# Altium schematic sheet Esquematico.SchDoc
size A4
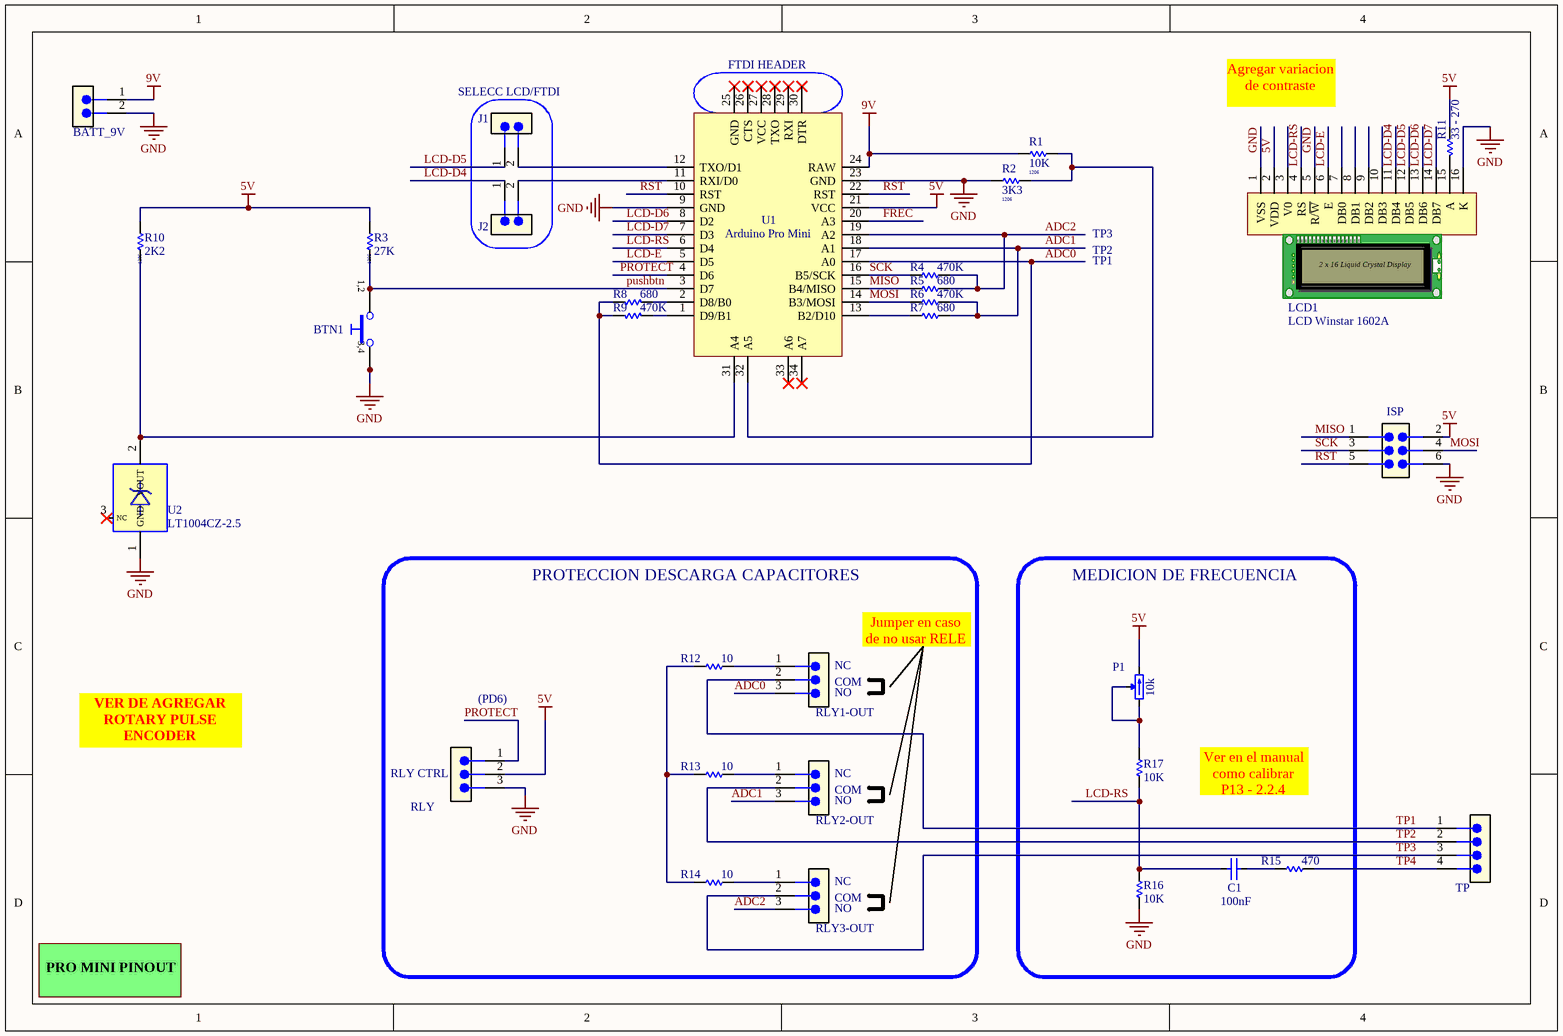
[diagram p0: Esquematico.SchDoc]

## Parts
BATT_9V  M20-9 73 02 46  [HEADER2X1]  (value not drawn)
BTN1  Push Button  [PB_OMRON_B3F-1070]  (value not drawn)
C1  100nF  [1206 - CAP]
ISP  M20-9 72 03 46  [HEADER3X2]  (value not drawn)
J1  M20-9 73 02 46  [HEADER2X1]  (value not drawn)
J2  M20-9 73 02 46  [HEADER2X1]  (value not drawn)
LCD1  LCD Winstar 1602A  [LCD_1602A]
P1  10k  [TRIM_BOURNS_3266W]
R1  10K  Package: 1206  [1206 - RES]
R2  3K3  Package: 1206  [1206 - RES]
R3  27K  Package: 1206  [1206 - RES]
R4  470K  [1206 - RES]
R5  680  [1206 - RES]
R6  470K  [1206 - RES]
R7  680  [1206 - RES]
R8  680  [1206 - RES]
R9  470K  [1206 - RES]
R10  2K2  Package: 1206  [1206 - RES]
R11  33 - 270  [1206 - RES]
R12  10  [1206 - RES]
R13  10  [1206 - RES]
R14  10  [1206 - RES]
R15  470  [1206 - RES]
R16  10K  [1206 - RES]
R17  10K  [1206 - RES]
RLY  HEADER 3X1  [HEADER3X1]  (value not drawn)
RLY1-OUT  HEADER 3X1  [HEADER3X1]  (value not drawn)
RLY2-OUT  HEADER 3X1  [HEADER3X1]  (value not drawn)
RLY3-OUT  HEADER 3X1  [HEADER3X1]  (value not drawn)
TP  M20-9 73 04 46  [HEADER4X1]  (value not drawn)
U1  Arduino Pro Mini  [Arduino Pro Mini]
U2  LT1004CZ-2.5  [TO-92]

## Blocks framed on the sheet
PROTECCION DESCARGA CAPACITORES: R12-R14 RLY RLY1-OUT RLY2-OUT RLY3-OUT
MEDICION DE FRECUENCIA: C1 P1 R15-R17

## Sub-sheets
PRO MINI PINOUT = PinOut.SchDoc: no entries

## Nets
5V: ISP.2 LCD1.2(VDD) P1.3(CW) R3.2 R10.2 R11.2 RLY.2 U1.21(VCC)
9V: BATT_9V.1 R1.2 U1.24(RAW)
GND: BATT_9V.2 BTN1.3 BTN1.4 ISP.6 LCD1.1(VSS) LCD1.5(R/~{W}) LCD1.16(K) R2.2 R16.1 RLY.3 U1.9(GND) U1.23(GND) U2.1(GND)
ADC0: R8.1 R9.1 RLY1-OUT.3 U1.17(A0)
ADC1: R6.1 R7.1 RLY2-OUT.3 U1.18(A1)
ADC2: R4.1 R5.1 RLY3-OUT.3 U1.19(A2)
FREC: U1.20(A3)
LCD-D4: J2.1 LCD1.11(DB4)
LCD-D5: J1.1 LCD1.12(DB5)
LCD-D6: LCD1.13(DB6) U1.8(D2)
LCD-D7: LCD1.14(DB7) U1.7(D3)
LCD-E: LCD1.6(E) U1.5(D5)
LCD-RS: C1.1 LCD1.4(RS) R16.2 R17.1 U1.6(D4)
MISO: ISP.1 R5.2 U1.15(B4/MISO)
MOSI: ISP.4 R6.2 U1.14(B3/MOSI)
PROTECT: RLY.1 U1.4(D6)
pushbtn: BTN1.1 BTN1.2 R3.1 U1.3(D7)
RST: ISP.5 U1.10(RST) U1.22(RST)
SCK: ISP.3 R4.2 U1.16(B5/SCK)
TP1: RLY1-OUT.2 TP.1
TP2: RLY2-OUT.2 TP.2
TP3: RLY3-OUT.2 TP.3
TP4: R15.1 TP.4
NetC1_2: C1.2 R15.2
NetJ1_2: J1.2 U1.12(TXO/D1)
NetJ2_2: J2.2 U1.11(RXI/D0)
NetLCD1_15: LCD1.15(A) R11.1
NetP1_1: P1.1(CCW) P1.2(W) R17.2
NetR1_1: R1.1 R2.1 U1.32(A5)
NetR7_2: R7.2 U1.13(B2/D10)
NetR8_2: R8.2 U1.2(D8/B0)
NetR9_2: R9.2 U1.1(D9/B1)
NetR10_1: R10.1 U1.31(A4) U2.2(VOUT)
NetR12_1: R12.1 RLY1-OUT.1
NetR12_2: R12.2 R13.2 R14.2
NetR13_1: R13.1 RLY2-OUT.1
NetR14_1: R14.1 RLY3-OUT.1

Not connected (* = marked no-connect by the designer): LCD1 3(V0) 7(DB0) 8(DB1) 9(DB2) 10(DB3); U1 25(GND)* 26(CTS)* 27(VCC)* 28(TXO)* 29(RXI)* 30(DTR)* 33(A6)* 34(A7)*; U2 3(NC)*

## Notes on the sheet
- (near J1) SELECC LCD/FTDI
- (near U1) FTDI HEADER
- Agregar variacion de contraste
- TP2
- TP3
- TP1
- Jumper en caso
  de no usar RELE
- (PD6)
- (near RLY1-OUT) NC
- (near RLY1-OUT) COM
- (near RLY1-OUT) NO
- VER DE AGREGAR ROTARY PULSE ENCODER
- (near RLY) RLY CTRL
- (near RLY2-OUT) NC
- (near RLY2-OUT) COM
- Ver en el manual como calibrar
  P13 - 2.2.4
- (near RLY2-OUT) NO
- (near RLY3-OUT) NC
- (near RLY3-OUT) COM
- (near RLY3-OUT) NO
- (in symbol LCD Winstar 1602A) 2 x 16 Liquid Crystal Display
- (in symbol SW TACT LONG 4Pin) 1,2; 3,4

## Library data of the parts
BATT_9V J1 J2 = HEADER 2X1: Header recto M 100 mils pitch 2x1; Manufacturer: Harwin; ComponentStatus: Active; Contacts: 2; EM_Case: NA; Gender: Male; Imax: 3 A; INVAPDescriptionEN: Header, Male, Male, 2, NA; INVAPDescriptionES: Header, Macho, Male, 2, NA; Notes: Corresponde a corte de una tira de 40, se utilizará el equivalente disponible en depósito, HDSIF19040GT; SolderingType: Manual; SubTypeES: Macho; Vmax: 800 V; Case: NA; Category: Conventional; DatasheetURL: https://cdn.harwin.com/pdfs/Harwin_PC_Connectors_M20.pdf; EM_Manufacturer: NA; EM_Mfr_PartNum: NA; EM_Mfr_Reel_PartNum: NA; FM_Case: NA; FM_Manufacturer: NA; FM_Mfr_PartNum: NA; FM_Mfr_Reel_PartNum: NA; Footprint_INVAP: HEADER2X1; MilitarySTD: NA; Mil_PartNum: NA; MountingType: TH; PartNumber: M20-9 73 02 46; Reel_PartNumber: NA; SubTypeEN: Male; TempMax: 105 °C; TempMin: -40 °C; TypeEN: Header; TypeES: Header; Weight: 0,12 gr; CM_Case: NA; CM_Manufacturer: Harwin; CM_Mfr_PartNum: M20-9 73 02 46; CM_Mfr_Reel_PartNum: NA; CM_Notes: Corresponde a corte de una tira de 40, se utilizará el equivalente disponible en depósito, HDSIF19040GT; EM_Notes: NA; FM_Notes: NA
BTN1 = SW TACT LONG 4Pin: Push-Button Switch SPDT; Part Description: 24VDC 50mA SPST-NO Tactile Push-Button Switch (h=9.5mm); Manufacturer: OMRON; Manufacturer Part Number: B3F-1070; Table: Switches; Part Number: PB_OMRON_B3F-1070; Component Kind: Standard; Component Type: Standard; Pin Count: 4; PackageDescription: 6x6mm Model, Horizontal, Flat Plunger Type (without Ground Terminal) Pushbutton Switch, OMRON B3F Series; Family: Push Button; Mounted: Yes; Socket: No; SMD: No; Status: None; ComponentHeight: 9.5mm; HelpURL: \\cern.ch\dfs\Applications\Altium\Datasheets\PB_OMRON_B3F-1070.pdf; Author: CERN DEM JLC; CreateDate: 06/05/2009; LatestRevisionDate: 06/05/2009
C1 = CAP_1206: Value: 100nF; Package: 1206
ISP = HEADER 3X2: Header recto M 100 mils pitch 3x2; Manufacturer: Harwin; ComponentStatus: Active; Contacts: 6; EM_Case: NA; Gender: Male; Imax: 3 A; INVAPDescriptionEN: Header, Male, Male, 6, NA; INVAPDescriptionES: Header, Macho, Male, 6, NA; Notes: Corresponde a corte de una tira de 40, se utilizará el equivalente disponible en depósito, HDDFI2x40GT; SolderingType: Manual; SubTypeES: Macho; Vmax: 800 V; Case: NA; Category: Conventional; DatasheetURL: https://cdn.harwin.com/pdfs/Harwin_PC_Connectors_M20.pdf; EM_Manufacturer: NA; EM_Mfr_PartNum: NA; EM_Mfr_Reel_PartNum: NA; FM_Case: NA; FM_Manufacturer: NA; FM_Mfr_PartNum: NA; FM_Mfr_Reel_PartNum: NA; Footprint_INVAP: HEADER3X2; MilitarySTD: NA; Mil_PartNum: NA; MountingType: TH; PartNumber: M20-9 72 03 46; Reel_PartNumber: NA; SubTypeEN: Male; TempMax: 105 °C; TempMin: -40 °C; TypeEN: Header; TypeES: Header; Weight: 0,36 gr; CM_Case: NA; CM_Manufacturer: Harwin; CM_Mfr_PartNum: M20-9 72 03 46; CM_Mfr_Reel_PartNum: NA; CM_Notes: Corresponde a corte de una tira de 40, se utilizará el equivalente disponible en depósito, HDDFI2x40GT; EM_Notes: NA; FM_Notes: NA
LCD1 = LCD Winstar 1602A: 16x2 4-Bit Parallel LCD display HD44780 compatible
P1 = Trimming Pot THD: Part Number: TRIM_12T_10K_BOURNS_3266W-1-103LF; Part Description: 12 Turn Trimming Potentiometer (Top Adjustement); Manufacturer: BOURNS; Manufacturer Part Number: 3266W-1-103LF; Power: 0.25W; TC: ±100ppm/°C; Tolerance: ±10%; PressFit: No; Component Kind: Standard; Component Type: Standard; Pin Count: 3; Value: 10k; Case: 3266W; Mounted: Yes; Socket: No; SMD: No; Sense: No; ComponentHeight: 7.75mm; HelpURL: \\cern.ch\dfs\Applications\Altium\Datasheets\TRIM_BOURNS_3266W.pdf; Author: CERN DEM JLC; CreateDate: 10/06/2008; LatestRevisionDate: 28/11/2012
R1-R7 R10-R17 = RES_1206
  R1: Value: 10K
  R2: Value: 3K3
  R3: Value: 27K
  R4 R6: Value: 470K; Package: 1206
  R5 R7: Value: 680; Package: 1206
  R10: Value: 2K2
  R11: Value: 33 - 270; Package: 1206
  R12-R14: Value: 10; Package: 1206
  R15: Value: 470; Package: 1206
  R16 R17: Value: 10K; Package: 1206
R8 = RES_1206: Value: 470K; Package: 1206
R9 = RES_1206: Value: 680; Package: 1206
TP = HEADER 4X1: Header recto M 100 mils pitch 4x1; Manufacturer: Harwin; ComponentStatus: Active; Contacts: 4; EM_Case: NA; Gender: Male; Imax: 3 A; INVAPDescriptionEN: Header, Male, Male, 4, NA; INVAPDescriptionES: Header, Macho, Male, 4, NA; SolderingType: Manual; SubTypeES: Macho; Vmax: 800 V; Case: NA; Category: Conventional; DatasheetURL: https://cdn.harwin.com/pdfs/Harwin_PC_Connectors_M20.pdf; EM_Manufacturer: NA; EM_Mfr_PartNum: NA; EM_Mfr_Reel_PartNum: NA; FM_Case: NA; FM_Manufacturer: NA; FM_Mfr_PartNum: NA; FM_Mfr_Reel_PartNum: NA; Footprint_INVAP: HEADER4X1; MilitarySTD: NA; Mil_PartNum: NA; MountingType: TH; PartNumber: M20-9 73 04 46; Reel_PartNumber: NA; SubTypeEN: Male; TempMax: 105 °C; TempMin: -40 °C; TypeEN: Header; TypeES: Header; Weight: 0,24 gr; CM_Case: NA; CM_Manufacturer: Harwin; CM_Mfr_PartNum: M20-9 73 04 46; CM_Mfr_Reel_PartNum: NA; EM_Notes: NA; FM_Notes: NA
U2 = LT1004CZ-2.5: VREF SHUNT 2.5V TO-92; Manufacturer: Analog Devices; Iout: 20 mA; SubTypeEN: 2-terminal bandgap reference diode 2.5V; SubTypeES: Diodo de referencia de 2 terminales 2.5V; Case: TO-92; DatasheetURL: http://www.analog.com/media/en/technical-documentation/data-sheets/1004fc.pdf; PartNumber: LT1004CZ-2.5; Vout: 2.5 V